# Altium schematic sheet 1_P1.schdoc
size 429 x 307 mm; Symbol: Drawing-Symbol_A4; Device: Drawing-Symbol_A4; Company: 嘉立创EDA; Version: V1.0; Page Size: A4; @Project Name: PCB1; @Page Count: 1; @Update Date: 2025-07-09; @Create Date: 2025-07-09; @Schematic Name: Schematic2; @Page No: 1; @Page Name: P1; @Create Time: 14:20:13; @Update Time: 20:42:47; Width: 1655; Height: 1170; Region Start: 1; X Region Count: 6; Y Region Count: 4; Blade Width: 10; Title Block Position: 3; @Board Name: 霍尔模块
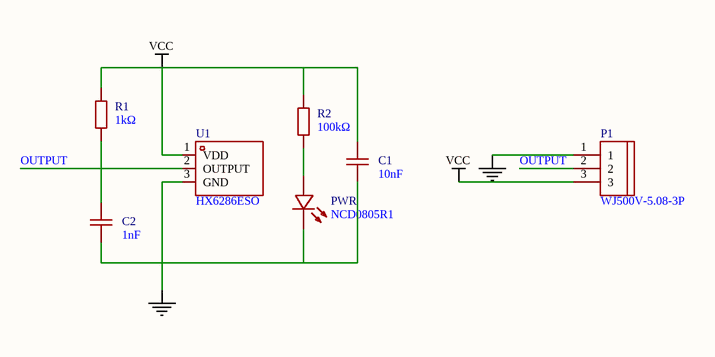
[diagram p0: 1_P1.schdoc]

## Parts
C1  10nF  [C0603]
C2  1nF  [C0603]
P1  WJ500V-5.08-3P  [CONN-TH_3P-P5.00_WJ500V-5.08-3P]
PWR  NCD0805R1  [LED0805-R-RD]
R1  1kΩ  [R0603]
R2  100kΩ  [R0603]
U1  HX6286ESO  [SOT-23-3_L2.9-W1.6-P1.90-LS2.8-BR]

## Nets
GND: C1.1 C2.1 P1.1 PWR.2(-) U1.3(GND)
VCC: C1.2 P1.3 R1.2 R2.2 U1.1(VDD)
OUTPUT: C2.2 P1.2 R1.1 U1.2(OUTPUT)
NetPWR_1: PWR.1(+) R2.1

## Notes on the sheet
- 1
- 2
- 3
- 4
- 5
- 6
- A
- B
- C
- 原理图
- Schematic2
- 创建日期
- 更新日期
- 2025-07-09
- D
- 板子
- 绘制
- 霍尔模块
- 图页
- P1
- 审阅
- 版本
- 尺寸
- PCB1
- 页    1    共    1
- V1.0
- A4
- 嘉立创EDA

## Library data of the parts
C1 = CC0603KRX7R9BB103: Manufacturer: YAGEO(国巨); Add into BOM: yes; Tolerance: ±10%; Voltage Rated: 50V; Temperature Coefficient: X7R; Symbol: CC0603KRX7R9BB103; Device: CC0603KRX7R9BB103; LCSC Part Name: 10nF ±10% 50V; Supplier Part: C100042; Manufacturer Part: CC0603KRX7R9BB103; Supplier Footprint: 0603; JLCPCB Part Class: 扩展库; Datasheet: https://atta.szlcsc.com/upload/public/pdf/source/20181008/C309510_22F155564471FAF6A489F7D68F34234E.pdf; Supplier: LCSC; Convert to PCB: yes; Value: 10nF
C2 = CL10B102KB8NNNC: Manufacturer: SAMSUNG(三星); Add into BOM: yes; Tolerance: ±10%; Voltage Rated: 50V; Temperature Coefficient: X7R; Symbol: CL10B102KB8NNNC; Device: CL10B102KB8NNNC; LCSC Part Name: 1nF ±10% 50V; Supplier Part: C1588; Manufacturer Part: CL10B102KB8NNNC; Supplier Footprint: 0603; JLCPCB Part Class: 基础库; Datasheet: https://atta.szlcsc.com/upload/public/pdf/source/20160218/1457707763339.pdf; Supplier: LCSC; Convert to PCB: yes; Value: 1nF
P1 = WJ500V-5.08-3P: Manufacturer: KANGNEX(康奈克斯电气); Symbol: WJ500V-5.08-3P-14-00A; Add into BOM: yes; Structure: 1x3P; Pitch: 5.08mm; Current Rating (Max): 18A; Voltage Rating (Max): 250V; Wire Gauge - AWG: 14~30; Wire Gauge - mm2: 2.5; Number of PINs Per Row: 3; Device: WJ500V-5.08-3P; LCSC Part Name: 5.08mm 1x3P 排数:1 每排P数:3 直插; Supplier Part: C72334; Manufacturer Part: WJ500V-5.08-3P; Supplier Footprint: 插件,P=5.08mm; JLCPCB Part Class: 扩展库; Datasheet: https://atta.szlcsc.com/upload/public/pdf/source/20191225/C72334_8A5EF831D67650233B6B1E3F2BC06274.pdf; Supplier: LCSC; Convert to PCB: yes; Color: 绿色; Mounting Style: 直插; Number of Pins: 3P; Number of Rows: 1; Operating Temperature Range: -40℃~+105℃
PWR = NCD0805R1: Manufacturer: 国星光电; Symbol: FC-2012HRK-620D; Add into BOM: yes; Emitted Color: 红色; Forward Voltage (VF): 1.6V~2.6V; Power Dissipation: 65mW; Forward Current: 20mA; Dominant Wavelength: 615nm~630nm; Diode Configuration: 独立二极管; Lens Color: 无色透明透镜; Luminous Intensity: 67mcd~195mcd; Viewing Angle: 130°; Device: NCD0805R1; LCSC Part Name: NCD0805R1; Supplier Part: C84256; Manufacturer Part: NCD0805R1; Supplier Footprint: 0805; JLCPCB Part Class: 基础库; Datasheet: https://atta.szlcsc.com/upload/public/pdf/source/20200820/C84256_F0A75A43B3EAD75808600A0514C76B99.pdf; Supplier: LCSC; Convert to PCB: yes; Lamp Holder Type: -; Peak Wavelength: -; Color Temperature: -; Mounting Sytle: -; Operating Temperature: -30℃~+85℃
R1 = RT0603BRD071KL: Manufacturer: YAGEO(国巨); Add into BOM: yes; Tolerance: ±0.1%; Power(Watts): 100mW; Overload Voltage (Max): 75V; Temperature Coefficient: ±25ppm/℃; Symbol: RT0603BRD071KL; Device: RT0603BRD071KL; LCSC Part Name: 薄膜电阻 1kΩ ±0.1% 100mW; Supplier Part: C110776; Manufacturer Part: RT0603BRD071KL; Supplier Footprint: 0603; JLCPCB Part Class: 扩展库; Datasheet: https://atta.szlcsc.com/upload/public/pdf/source/20170704/1499151282044.pdf; Supplier: LCSC; Convert to PCB: yes; Type: 薄膜电阻; Value: 1kΩ; Operating Temperature Range: -55℃~+155℃
R2 = RC0603FR-07100KL: Manufacturer: YAGEO(国巨); Add into BOM: yes; Tolerance: ±1%; Power(Watts): 100mW; Overload Voltage (Max): 75V; Temperature Coefficient: ±100ppm/℃; Symbol: RC0603FR-07100KL; Device: RC0603FR-07100KL; LCSC Part Name: 厚膜电阻 100kΩ ±1% 100mW; Supplier Part: C14675; Manufacturer Part: RC0603FR-07100KL; Supplier Footprint: 0603; JLCPCB Part Class: 扩展库; Datasheet: https://atta.szlcsc.com/upload/public/pdf/source/20140324/1457707028752.pdf; Supplier: LCSC; Convert to PCB: yes; Type: 厚膜电阻; Value: 100kΩ; Operating Temperature Range: -55℃~+155℃
U1 = HX6286ESO: Manufacturer: HUAXIN(华芯); Add into BOM: yes; Symbol: HX6286ESO; Device: HX6286ESO; LCSC Part Name: 高灵敏度单极霍尔元件霍尔开关; Supplier Part: C495736; Manufacturer Part: HX6286ESO; Supplier Footprint: SOT-23; Datasheet: https://atta.szlcsc.com/upload/public/pdf/source/20240416/91709893A05D2E615D9B7FCF02719893.pdf; Supplier: LCSC; Convert to PCB: yes